# Altium project ESP_MusicToy.PrjPcb (part 1 of 2)
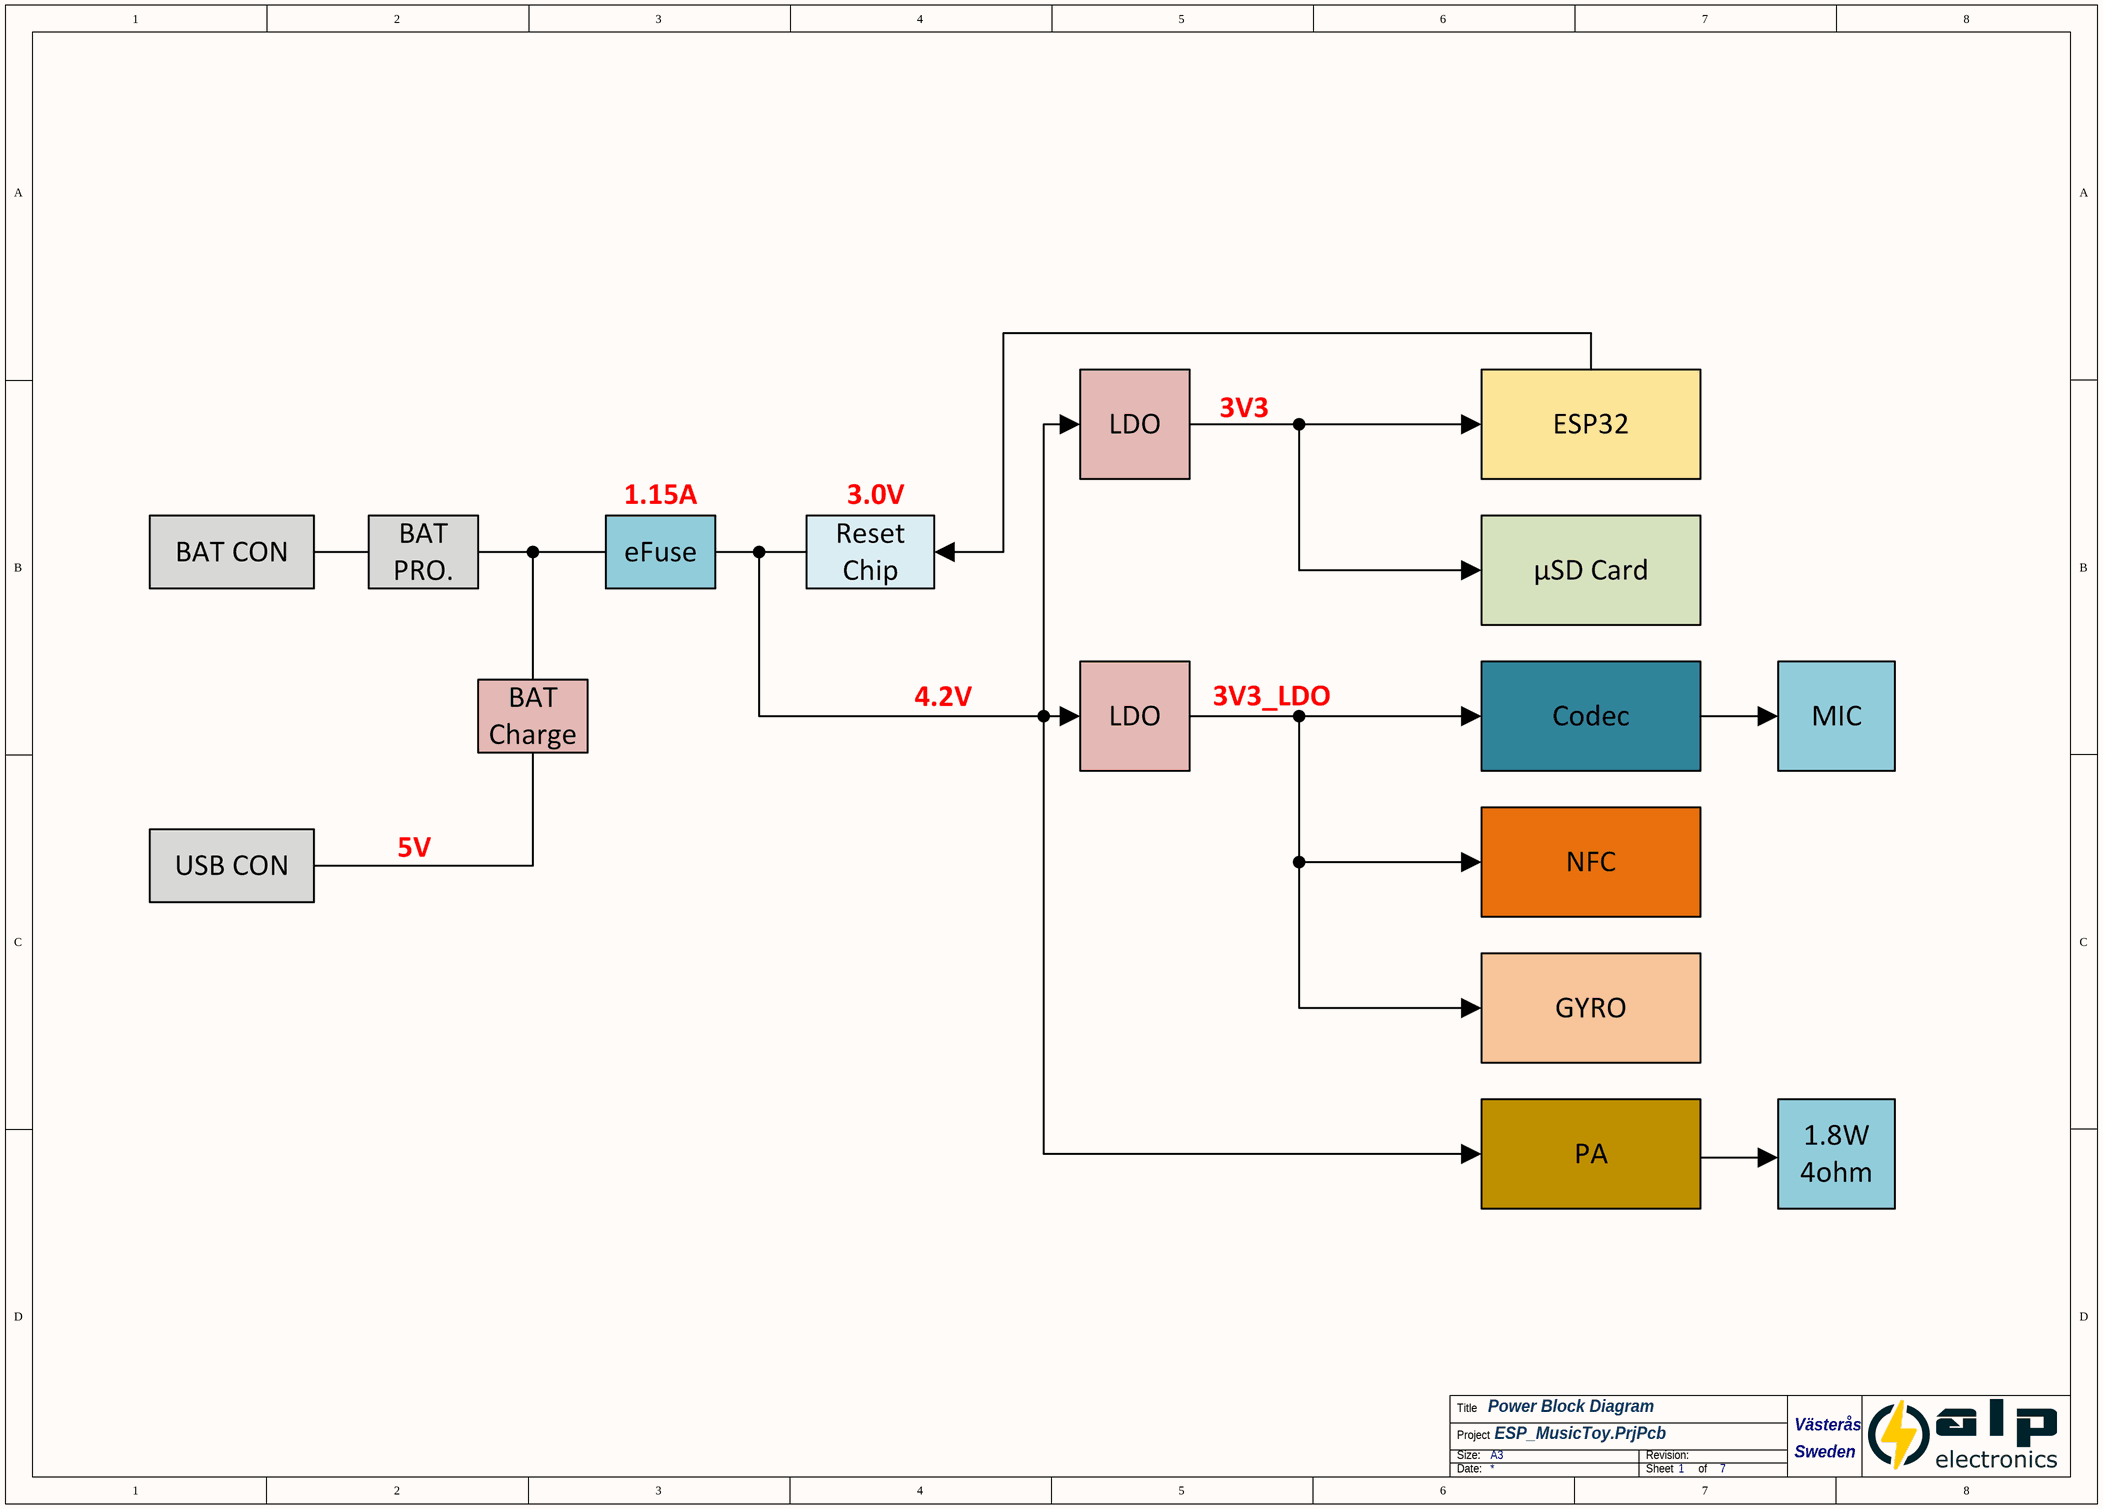
[diagram p0: [00] Power Block Diagram.SchDoc]
8 sheets, 197 parts. Net scope: flat (ports and power ports of the same name join across sheets).
Board file: ESP_MusicToy.PcbDoc
Sheets:
  [00] Power Block Diagram.SchDoc
  [01] System Block Diagram.SchDoc
  [02] ESP32-S2 Module.SchDoc
  [03] Codec.SchDoc
  [04] Power & Battery.SchDoc
  [05] NFC.SchDoc
  [06] Gyroscope.SchDoc
  [07] Information.SchDoc

## Sheet [00] Power Block Diagram.SchDoc: Power Block Diagram
size A3; Author: Caner ALP; Organization: ALP Electronics; Address1: Axel Oxenstiernas; Address2: Västerås; Address3: 72478; Address4: Sweden; DocumentNumber: 1; SheetNumber: 1; SheetTotal: 7

### Notes on the sheet
- Title
- Size:
- Project
- A3
- Revision:
- Date:
- Sheet
- of

## Sheet [01] System Block Diagram.SchDoc: System Block Diagram
size A3; Author: Caner ALP; Organization: ALP Electronics; Address1: Axel Oxenstiernas; Address2: Västerås; Address3: 72478; Address4: Sweden; DocumentNumber: 2; SheetNumber: 2; SheetTotal: 7

### Notes on the sheet
- Title
- Size:
- Project
- A3
- Revision:
- Date:
- Sheet
- of
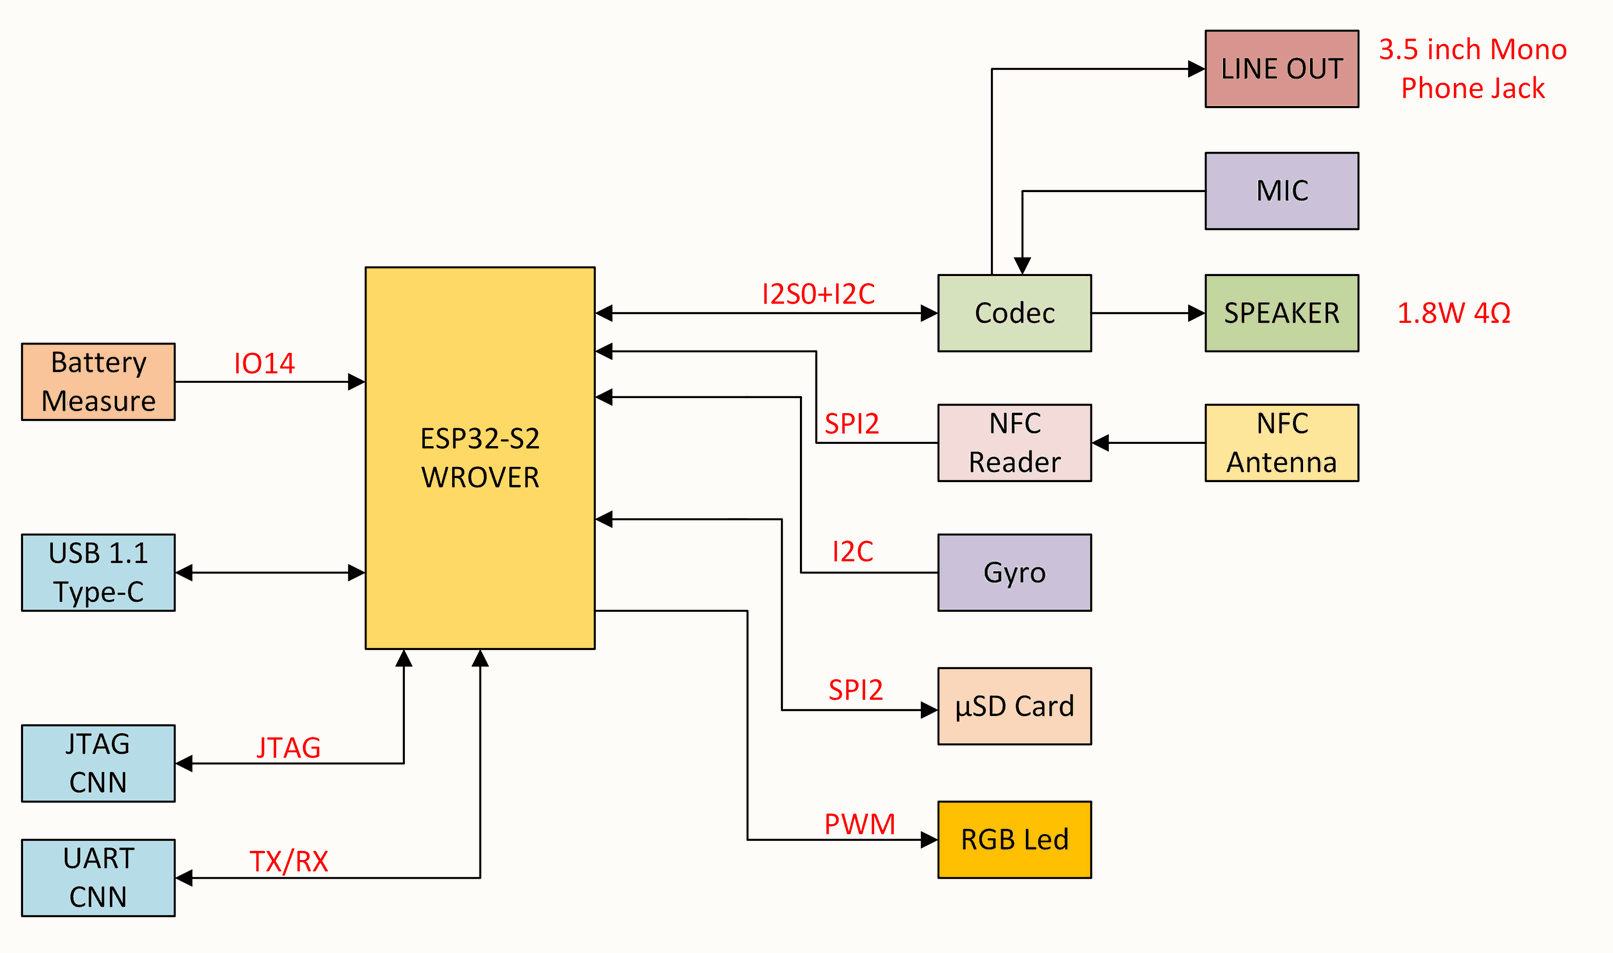
[diagram p1: [01] System Block Diagram.SchDoc]

## Sheet [02] ESP32-S2 Module.SchDoc: ESP32-S2 WROVER Module
size A3; Author: Caner ALP; Organization: ALP Electronics; Address1: Axel Oxenstiernas; Address2: Västerås; Address3: 72478; Address4: Sweden; DocumentNumber: 3; SheetNumber: 3; SheetTotal: 7
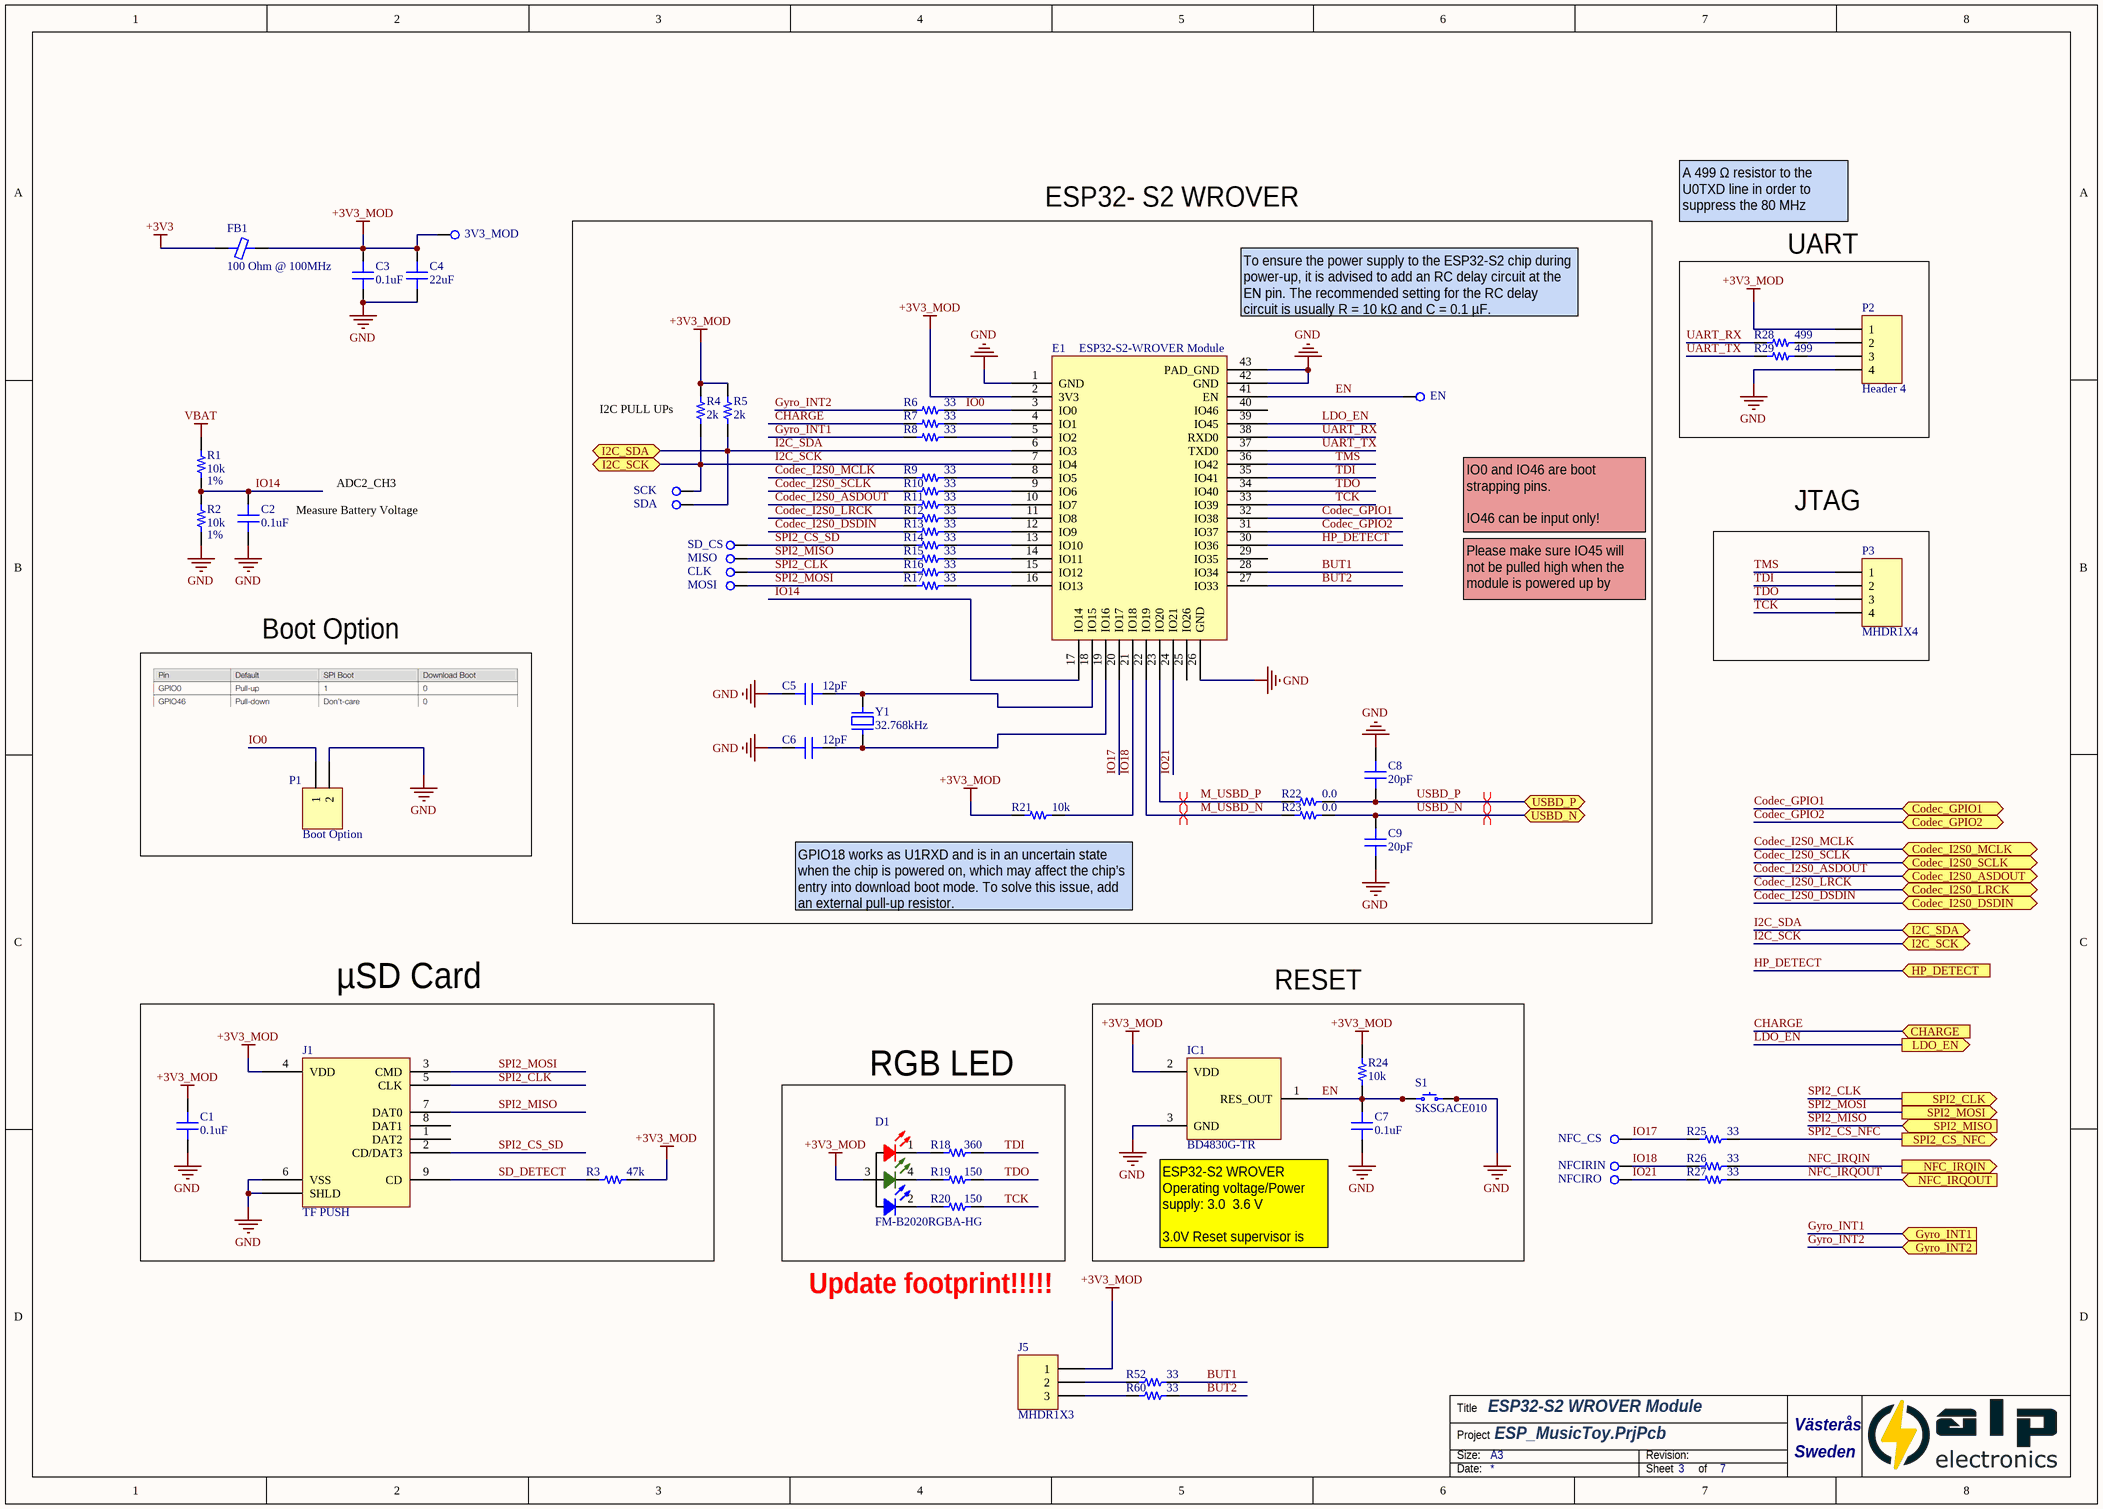
[diagram p2: [02] ESP32-S2 Module.SchDoc]

### Parts
3V3_MOD  RCT-0C  [TE TP 0805]  (value not drawn)
C1  0.1uF  [CAP 0402/1005]
C2  0.1uF  [CAP 0402/1005]
C3  0.1uF  [CAP 0402/1005]
C4  22uF  [CAP 0603/1608]
C5  12pF  [CAP 0402/1005]
C6  12pF  [CAP 0402/1005]
C7  0.1uF  [CAP 0402/1005]
C8  20pF  [CAP 0402/1005]
C9  20pF  [CAP 0402/1005]
CLK  RCT-0C  [0.5mm-TestPad]  (value not drawn)
D1  FM-B2020RGBA-HG  [FM-B2020RGBA-HG]
E1  ESP32-S2-WROVER Module  [ESP32-S2-WROVER]
EN  RCT-0C  [0.5mm-TestPad]  (value not drawn)
FB1  100 Ohm @ 100MHz  [FER 0805/2012]
IC1  BD4830G-TR  [TI SOT-23-5 DBV]
J1  TF PUSH  [TF-PUSH]
J5  MHDR1X3  [MHDR1X3]
MISO  RCT-0C  [0.5mm-TestPad]  (value not drawn)
MOSI  RCT-0C  [0.5mm-TestPad]  (value not drawn)
NFC_CS  RCT-0C  [0.5mm-TestPad]  (value not drawn)
NFCIRIN  RCT-0C  [0.5mm-TestPad]  (value not drawn)
NFCIRO  RCT-0C  [0.5mm-TestPad]  (value not drawn)
P1  Boot Option  [HDR1X2]
P2  Header 4  [HDR1X4]
P3  MHDR1X4  [MHDR1X4]
R1  10k  Tolerance: 1%  [RES 0402/1005]
R2  10k  Tolerance: 1%  [RES 0402/1005]
R3  47k  [RES 0402/1005]
R4  2k  [RES 0402/1005]
R5  2k  [RES 0402/1005]
R6  33  [RES 0402/1005]
R7  33  [RES 0402/1005]
R8  33  [RES 0402/1005]
R9  33  [RES 0402/1005]
R10  33  [RES 0402/1005]
R11  33  [RES 0402/1005]
R12  33  [RES 0402/1005]
R13  33  [RES 0402/1005]
R14  33  [RES 0402/1005]
R15  33  [RES 0402/1005]
R16  33  [RES 0402/1005]
R17  33  [RES 0402/1005]
R18  360  [RES 0402/1005]
R19  150  [RES 0402/1005]
R20  150  [RES 0402/1005]
R21  10k  [RES 0402/1005]
R22  0.0  [RES 0402/1005]
R23  0.0  [RES 0402/1005]
R24  10k  [RES 0402/1005]
R25  33  [RES 0402/1005]
R26  33  [RES 0402/1005]
R27  33  [RES 0402/1005]
R28  499  [RES 0402/1005]
R29  499  [RES 0402/1005]
R52  33  [RES 0402/1005]
R60  33  [RES 0402/1005]
S1  SKSGACE010  [SKSGACE010]
SCK  RCT-0C  [0.5mm-TestPad]  (value not drawn)
SD_CS  RCT-0C  [0.5mm-TestPad]  (value not drawn)
SDA  RCT-0C  [0.5mm-TestPad]  (value not drawn)
Y1  32.768kHz  [ABRACON ABS07]

### Blocks framed on the sheet
ESP32- S2 WROVER: C5 C6 C8 C9 CLK E1 EN MISO MOSI R4-R17 R21-R23 SCK SD_CS SDA Y1
UART: P2 R28 R29
JTAG: P3
Boot Option: P1
µSD Card: C1 J1 R3
RESET: C7 IC1 R24 S1
RGB LED: D1 R18-R20

### Ports
CHARGE (in), Codec_GPIO1 (bidir), Codec_GPIO2 (bidir), Codec_I2S0_ASDOUT (bidir), Codec_I2S0_DSDIN (bidir), Codec_I2S0_LRCK (bidir), Codec_I2S0_MCLK (bidir), Codec_I2S0_SCLK (bidir), Gyro_INT1 (in), Gyro_INT2 (in), HP_DETECT (in), I2C_SCK (bidir), I2C_SDA (bidir), LDO_EN (out), NFC_IRQIN (out), NFC_IRQOUT (in), SPI2_CLK (out), SPI2_CS_NFC (out), SPI2_MISO (in), SPI2_MOSI (out), USBD_N (bidir), USBD_P (bidir)

### Nets
+3V3: FB1.1
+3V3_MOD: 3V3_MOD.1(TP) C1.2 C3.2 C4.2 D1.3 E1.2(3V3) FB1.2 IC1.2(VDD) J1.4(VDD) J5.1 P2.1 R3.2 R4.2 R5.2 R21.1 R24.2
GND: C1.1 C2.1 C3.1 C4.1 C5.1 C6.1 C7.1 C8.2 C9.1 E1.1(GND) E1.26(GND) E1.42(GND) E1.43(PAD_GND) IC1.3(GND) J1.6(VSS) J1.G(SHLD) P1.2 P2.4 R2.1 S1.3 S1.4
VBAT: R1.2
BUT1: E1.28(IO34) R52.2
BUT2: E1.27(IO33) R60.2
CHARGE: R7.1 ; port CHARGE
Codec_GPIO1: E1.32(IO38) ; port Codec_GPIO1
Codec_GPIO2: E1.31(IO37) ; port Codec_GPIO2
Codec_I2S0_ASDOUT: R11.1 ; port Codec_I2S0_ASDOUT
Codec_I2S0_DSDIN: R13.1 ; port Codec_I2S0_DSDIN
Codec_I2S0_LRCK: R12.1 ; port Codec_I2S0_LRCK
Codec_I2S0_MCLK: R9.1 ; port Codec_I2S0_MCLK
Codec_I2S0_SCLK: R10.1 ; port Codec_I2S0_SCLK
EN: C7.2 E1.41(EN) EN.1(TP) IC1.1(RES_OUT) R24.1 S1.1 S1.2
Gyro_INT1: R8.1 ; port Gyro_INT1
Gyro_INT2: R6.1 ; port Gyro_INT2
HP_DETECT: E1.30(IO36) ; port HP_DETECT
I2C_SCK: E1.7(IO4) R4.1 SCK.1(TP) ; port I2C_SCK
I2C_SDA: E1.6(IO3) R5.1 SDA.1(TP) ; port I2C_SDA
IO0: E1.3(IO0) P1.1 R6.2
IO14: C2.2 E1.17(IO14) R1.1 R2.2
IO17: E1.20(IO17) NFC_CS.1(TP) R25.1
IO18: E1.21(IO18) NFCIRIN.1(TP) R21.2 R26.1
IO21: E1.24(IO21) NFCIRO.1(TP) R27.1
LDO_EN: E1.39(IO45) ; port LDO_EN
M_USBD_N: E1.22(IO19) R23.1
M_USBD_P: E1.23(IO20) R22.1
NFC_IRQIN: R26.2 ; port NFC_IRQIN
NFC_IRQOUT: R27.2 ; port NFC_IRQOUT
SD_DETECT: J1.9(CD) R3.1
SPI2_CLK: CLK.1(TP) J1.5(CLK) R16.1 ; port SPI2_CLK
SPI2_CS_NFC: R25.2 ; port SPI2_CS_NFC
SPI2_CS_SD: J1.2(CD/DAT3) R14.1 SD_CS.1(TP)
SPI2_MISO: J1.7(DAT0) MISO.1(TP) R15.1 ; port SPI2_MISO
SPI2_MOSI: J1.3(CMD) MOSI.1(TP) R17.1 ; port SPI2_MOSI
TCK: E1.33(IO39) P3.4 R20.2
TDI: E1.35(IO41) P3.2 R18.2
TDO: E1.34(IO40) P3.3 R19.2
TMS: E1.36(IO42) P3.1
UART_RX: E1.38(RXD0) R28.1
UART_TX: E1.37(TXD0) R29.1
USBD_N: C9.2 R23.2 ; port USBD_N
USBD_P: C8.1 R22.2 ; port USBD_P
NetC5_2: C5.2 E1.18(IO15) Y1.2
NetC6_2: C6.2 E1.19(IO16) Y1.1
NetD1_1: D1.1 R18.1
NetD1_2: D1.2 R20.1
NetD1_4: D1.4 R19.1
NetE1_4: E1.4(IO1) R7.2
NetE1_5: E1.5(IO2) R8.2
NetE1_8: E1.8(IO5) R9.2
NetE1_9: E1.9(IO6) R10.2
NetE1_10: E1.10(IO7) R11.2
NetE1_11: E1.11(IO8) R12.2
NetE1_12: E1.12(IO9) R13.2
NetE1_13: E1.13(IO10) R14.2
NetE1_14: E1.14(IO11) R15.2
NetE1_15: E1.15(IO12) R16.2
NetE1_16: E1.16(IO13) R17.2
NetJ5_2: J5.2 R52.1
NetJ5_3: J5.3 R60.1
NetP2_2: P2.2 R28.2
NetP2_3: P2.3 R29.2

Not connected (* = marked no-connect by the designer): E1 25(IO26) 29(IO35) 40(IO46); IC1 4(NC) 5(NC); J1 1(DAT2) 8(DAT1)

### Layout directives
differential pair; differential pair class DIFF_USB: M_USBD_N, M_USBD_P, USBD_N, USBD_P

### Notes on the sheet
- A 499 Ω resistor to the U0TXD line in order to suppress the 80 MHz harmonics.
- To ensure the power supply to the ESP32-S2 chip during power-up, it is advised to add an RC delay circuit at the EN pin. The recommended setting for the RC delay circuit is usually R = 10 kΩ and C = 0.1 µF.
- (near R4) I2C PULL UPs
- (near C2) Measure Battery Voltage
- ADC2_CH3
- IO0 and IO46 are boot strapping pins.
  IO46 can be input only!
- Please make sure IO45 will not be pulled high when the module is powered up by eternal circuit.
- (near R21) GPIO18 works as U1RXD and is in an uncertain state when the chip is powered on, which may affect the chip’s entry into download boot mode. To solve this issue, add an external pull-up resistor.
- ESP32-S2 WROVER Operating voltage/Power supply: 3.0  3.6 V
  3.0V Reset supervisor is used.
- Update footprint!!!!!
- Title
- Size:
- Project
- A3
- Revision:
- Date:
- Sheet
- of

### Library data of the parts
3V3_MOD CLK EN MISO MOSI NFC_CS NFCIRIN NFCIRO SCK SD_CS SDA = RCT-0C: 0805 PROBE PAD; Manufacturer: TE Connectivity AMP Connectors; Part Number: RCT-0C; PartId: 15704; Supplier 1: Digi-Key; Supplier Part Number 1: A106144CT-ND; ComponentLink1Description: Datasheet; ComponentLink1URL: http://www.te.com/commerce/DocumentDelivery/DDEController?Action=srchrtrv&DocNm=1773266&DocType=DS&DocLang=English; ComponentLink2Description: Digi-Key Listing; ComponentLink2URL: http://www.digikey.com/product-detail/en/te-connectivity-amp-connectors/RCT-0C/A106144CT-ND/3477801; Price: 0,14; Type: PC Test Point; Mounting Type: Surface Mount
C1-C3 C7 = C1005X7R1A104K050BB: CAP CER 0.1UF 10V X7R 0402; Manufacturer: TDK Corporation; TemperatureRange: -55C ~ 125C; Tolerance: 10%; Value: 0.1uF; Part Number: C1005X7R1A104K050BB; PartId: 3900; Supplier 1: Digi-Key; Supplier Part Number 1: 445-4958-2-ND; ComponentLink1Description: Datasheet; ComponentLink1URL: https://product.tdk.com/info/en/catalog/datasheets/mlcc_commercial_general_en.pdf; ComponentLink2Description: Digi-Key listing; ComponentLink2URL: http://digikey.com/product-detail/en/C1005X7R1A104K050BB/445-4958-2-ND/2093226; TemperatureCoefficient: X7R; Voltage: 10V; Price: 0,0066; Type: -; Device Package: 0402 (1005 Metric)
C4 = C1608X5R1A226M080AC: CAP CER 22UF 10V X5R 0603; Manufacturer: TDK Corporation; TemperatureRange: -55C ~ 85C; Tolerance: 20%; Value: 22uF; Part Number: C1608X5R1A226M080AC; PartId: 12987; Supplier 1: Digi-Key; Supplier Part Number 1: 445-9077-2-ND; ComponentLink1Description: Datasheet; ComponentLink1URL: https://product.tdk.com/info/en/catalog/datasheets/mlcc_commercial_general_en.pdf; ComponentLink2Description: Digi-Key Listing; ComponentLink2URL: https://www.digikey.com/product-detail/en/tdk-corporation/C1608X5R1A226M080AC/445-9077-2-ND/3661560; TemperatureCoefficient: X5R; Voltage: 10V; Price: 0,105; Device Package: 0603 (1608 Metric)
C5 C6 = GRM1555C1E120JA01D: CAP CER 12PF 25V NP0 0402; Manufacturer: Murata Electronics North America; TemperatureRange: -55C ~ 125C; TemperatureCoefficient: C0G, NP0; Tolerance: 5%; Value: 12pF; Part Number: GRM1555C1E120JA01D; PartId: 4929; Supplier 1: Digi-Key; Supplier Part Number 1: 490-8170-2-ND; ComponentLink1Description: Datasheet; ComponentLink1URL: http://www.murata.com/~/media/webrenewal/support/library/catalog/products/capacitor/mlcc/c02e.ashx; ComponentLink2Description: Digi-Key listing; ComponentLink2URL: http://digikey.com/product-detail/en/GRM1555C1E120JA01D/490-8170-2-ND/3693719; Voltage: 25V; Price: 0,0069; Type: -; Device Package: 0402 (1005 Metric)
C8 C9 = GRM1555C1E200JA01D: CAP CER 20PF 25V NP0 0402; Manufacturer: Murata Electronics North America; TemperatureRange: -55C ~ 125C; TemperatureCoefficient: C0G, NP0; Tolerance: 5%; Value: 20pF; Part Number: GRM1555C1E200JA01D; PartId: 5066; Supplier 1: Digi-Key; Supplier Part Number 1: 490-11364-2-ND; ComponentLink1Description: Datasheet; ComponentLink1URL: http://www.murata.com/~/media/webrenewal/support/library/catalog/products/capacitor/mlcc/c02e.ashx; ComponentLink2Description: Digi-Key listing; ComponentLink2URL: http://digikey.com/product-detail/en/GRM1555C1E200JA01D/490-11364-2-ND/3693725; Voltage: 25V; Price: 0,0118; Type: -; Device Package: 0402 (1005 Metric)
D1 = FM-B2020RGBA-HG: RGB 615~630nmRed,515~535nmGreen,465~480nmBlue 2020; Manufacturer: Foshan NationStar Optoelectronics; Value: Green; Type: Surface Mount; Part Number: FM-B2020RGBA-HG; PartId: 10872; Supplier 1: LCSC; Supplier Part Number 1: C108793; ComponentLink1Description: Datasheet; ComponentLink1URL: https://datasheet.lcsc.com/szlcsc/1810231210_Foshan-NationStar-Optoelectronics-FM-B2020RGBA-HG_C108793.pdf; ComponentLink2Description: LCSC Listing; ComponentLink2URL: https://lcsc.com/product-detail/Light-Emitting-Diodes-LED_FM-B2020RGBA-HG_C108793.html; Device Package: 2020; Colour: RGB
FB1 = CIC21P101NE: FERRITE CHIP 100 OHM 2000MA 0805; Manufacturer: Samsung Electro-Mechanics America, Inc.; Type: Differential Mode - Single; DC Resistance: 20 mOhm Max; Current Rating: 2A; Part Number: CIC21P101NE; PartId: 6759; Value: 100 Ohm @ 100MHz; Supplier 1: Digi-Key; Supplier Part Number 1: 1276-6374-2-ND; ComponentLink1Description: Datasheet; ComponentLink1URL: http://www.samsungsem.com/kr/front/downloadcms.do?path=/kr/support/product-search/bead/__icsFiles/afieldfile/2014/11/13&fileName=S_CIC21J121NE.pdf; ComponentLink2Description: Digi-Key listing; ComponentLink2URL: http://digikey.com/product-detail/en/CIC21P101NE/1276-6374-2-ND/3973735; Price: 0,0163; Device Package: 0805 (2012 Metric)
IC1 = BD4830G-TR: IC MPU RESET CIRC 3V SOT23-5; Manufacturer: ROHM Semiconductor; Voltages Monitored: 1; Output: Open Drain or Open Collector; Reset: Active High; Voltage - Threshold: 3.0V; Part Number: BD4830G-TR; PartId: 16401; Supplier 1: LCSC; Supplier Part Number 1: C507475; ComponentLink1Description: Datasheet; ComponentLink1URL: https://datasheet.lcsc.com/szlcsc/2005211231_ROHM-Semicon-BD4830G-TR_C507475.pdf; ComponentLink2Description: LCSC Listing; ComponentLink2URL: https://lcsc.com/product-detail/PMIC-Supervisors_ROHM-Semicon-BD4830G-TR_C507475.html; Type: Simple Reset/Power-On Reset; Device Package: SOT23-5
J1 = TF PUSH: MICRO SD PUSH/PUSH SMALL 8C; Manufacturer: SHOU HAN; Number of Positions: 9(8 + 1); Connector Type: Connector and Ejector; Part Number: TF PUSH; PartId: 9290; Supplier 1: LCSC; Supplier Part Number 1: C393941; ComponentLink1Description: Datasheet; ComponentLink1URL: https://datasheet.lcsc.com/szlcsc/1912111437_SHOU-HAN-TF-PUSH_C393941.pdf; ComponentLink2Description: LCSC Listing; ComponentLink2URL: https://lcsc.com/product-detail/Card-Sockets-Connectors_SHOU-HAN-TF-PUSH_C393941.html; Type: Connector and Ejector; Mounting Type: Surface Mount, Right Angle; Features: Switch; Contact Finish: Nickel
J5 = MHDR1X3: Header, 3-Pin; LatestRevisionDate: 17-Jul-2002; LatestRevisionNote: Re-released for DXP Platform.; Publisher: Altium Limited
P1 = Header 2: Header, 2-Pin; LatestRevisionDate: 17-Jul-2002; LatestRevisionNote: Re-released for DXP Platform.; Publisher: Altium Limited
P2 = Header 4: Header, 4-Pin; LatestRevisionDate: 17-Jul-2002; LatestRevisionNote: Re-released for DXP Platform.; Publisher: Altium Limited
P3 = MHDR1X4: Header, 4-Pin; LatestRevisionDate: 17-Jul-2002; LatestRevisionNote: Re-released for DXP Platform.; Publisher: Altium Limited
R1 R2 = ERJ-2RKF1002X: RES SMD 10K OHM 1% 1/10W 0402; Manufacturer: Panasonic Electronic Components; TemperatureRange: -55C ~ 155C; TemperatureCoefficient: 100ppm/C; PowerRating: 0.1W, 1/10W; Value: 10k; Part Number: ERJ-2RKF1002X; PartId: 1; Supplier 1: Digi-Key; Supplier Part Number 1: P10.0KLTR-ND; ComponentLink1Description: Datasheet; ComponentLink1URL: http://industrial.panasonic.com/www-cgi/jvcr13pz.cgi?E+PZ+3+AOA0002+ERJ2RKF1002X+7+WW; ComponentLink2Description: Digikey listing; ComponentLink2URL: http://digikey.com/product-detail/en/ERJ-2RKF1002X/P10.0KLTR-ND/192073; Price: 0,0043; Type: Thick Film; Device Package: 0402 (1005 Metric)
R3 = RC0402JR-0747KL: RES SMD 47K OHM 5% 1/16W 0402; Manufacturer: Yageo; TemperatureRange: -55C ~ 155C; TemperatureCoefficient: 100ppm/C; PowerRating: 0.063W, 1/16W; Value: 47k; Part Number: RC0402JR-0747KL; PartId: 14467; Supplier 1: Digi-Key; Supplier Part Number 1: 311-47KJRTR-ND; ComponentLink1Description: Datasheet; ComponentLink1URL: http://www.yageo.com/documents/recent/PYu-RC_Group_51_RoHS_L_04.pdf; ComponentLink2Description: Digi-Key Listing; ComponentLink2URL: https://www.digikey.com/product-detail/en/yageo/RC0402JR-0747KL/311-47KJRTR-ND/726485; Tolerance: 5%; Price: 0,0017; Device Package: 0402 (1005 Metric)
R4 R5 = ERJ-2GEJ202X: RES SMD 2K OHM 5% 1/10W 0402; Manufacturer: Panasonic Electronic Components; TemperatureRange: -55C ~ 155C; TemperatureCoefficient: 200ppm/C; PowerRating: 0.1W, 1/10W; Value: 2k; Part Number: ERJ-2GEJ202X; PartId: 11049; Supplier 1: Digi-Key; Supplier Part Number 1: P2.0KJTR-ND; ComponentLink1Description: Datasheet; ComponentLink1URL: http://industrial.panasonic.com/www-cgi/jvcr13pz.cgi?E+PZ+3+AOA0001+ERJ2GEJ202X+7+WW; ComponentLink2Description: Digi-Key Listing; ComponentLink2URL: https://www.digikey.com/product-detail/en/panasonic-electronic-components/ERJ-2GEJ202X/P2.0KJTR-ND/146958; Tolerance: 5%; Price: 0,0019; Device Package: 0402 (1005 Metric)
R6-R17 R25-R27 R52 R60 = ERJ-2GEJ330X: RES SMD 33 OHM 5% 1/10W 0402; Manufacturer: Panasonic Electronic Components; TemperatureRange: -55C ~ 155C; TemperatureCoefficient: 200ppm/C; PowerRating: 0.1W, 1/10W; Value: 33; Part Number: ERJ-2GEJ330X; PartId: 10984; Supplier 1: Digi-Key; Supplier Part Number 1: P33JTR-ND; ComponentLink1Description: Datasheet; ComponentLink1URL: http://industrial.panasonic.com/www-cgi/jvcr13pz.cgi?E+PZ+3+AOA0001+ERJ2GEJ330X+7+WW; ComponentLink2Description: Digi-Key Listing; ComponentLink2URL: https://www.digikey.com/product-detail/en/panasonic-electronic-components/ERJ-2GEJ330X/P33JTR-ND/146980; Tolerance: 5%; Price: 0,0019; Device Package: 0402 (1005 Metric)
R18 = RC0402JR-07360RL: RES SMD 360 OHM 5% 1/16W 0402; Manufacturer: Yageo; TemperatureRange: -55C ~ 155C; TemperatureCoefficient: 100ppm/C; PowerRating: 0.063W, 1/16W; Value: 360; Part Number: RC0402JR-07360RL; PartId: 14562; Supplier 1: Digi-Key; Supplier Part Number 1: 311-360JRTR-ND; ComponentLink1Description: Datasheet; ComponentLink1URL: http://www.yageo.com/documents/recent/PYu-RC_Group_51_RoHS_L_04.pdf; ComponentLink2Description: Digi-Key Listing; ComponentLink2URL: https://www.digikey.com/product-detail/en/yageo/RC0402JR-07360RL/311-360JRTR-ND/726469; Tolerance: 5%; Price: 0,0017; Device Package: 0402 (1005 Metric)
R19 R20 = RC0402JR-07150RL: RES SMD 150 OHM 5% 1/16W 0402; Manufacturer: Yageo; TemperatureRange: -55C ~ 155C; TemperatureCoefficient: 100ppm/C; PowerRating: 0.063W, 1/16W; Value: 150; Part Number: RC0402JR-07150RL; PartId: 14495; Supplier 1: Digi-Key; Supplier Part Number 1: 311-150JRTR-ND; ComponentLink1Description: Datasheet; ComponentLink1URL: http://www.yageo.com/documents/recent/PYu-RC_Group_51_RoHS_L_04.pdf; ComponentLink2Description: Digi-Key Listing; ComponentLink2URL: https://www.digikey.com/product-detail/en/yageo/RC0402JR-07150RL/311-150JRTR-ND/726424; Tolerance: 5%; Price: 0,0017; Device Package: 0402 (1005 Metric)
R21 R24 = RC0402JR-0710KL: RES SMD 10K OHM 5% 1/16W 0402; Manufacturer: Yageo; TemperatureRange: -55C ~ 155C; TemperatureCoefficient: 100ppm/C; PowerRating: 0.063W, 1/16W; Value: 10k; Part Number: RC0402JR-0710KL; PartId: 14464; Supplier 1: Digi-Key; Supplier Part Number 1: 311-10KJRTR-ND; ComponentLink1Description: Datasheet; ComponentLink1URL: http://www.yageo.com/documents/recent/PYu-RC_Group_51_RoHS_L_04.pdf; ComponentLink2Description: Digi-Key Listing; ComponentLink2URL: https://www.digikey.com/product-detail/en/yageo/RC0402JR-0710KL/311-10KJRTR-ND/726418; Tolerance: 5%; Price: 0,0017; Device Package: 0402 (1005 Metric)
R22 R23 = AC0402JR-070RL: RES SMD 0.0OHM JUMPER 1/16W 0402; Manufacturer: Yageo; TemperatureRange: -55C ~ 155C; PowerRating: 0.063W, 1/16W; Value: 0.0; Part Number: AC0402JR-070RL; PartId: 16139; Supplier 1: Digi-Key; Supplier Part Number 1: 311-0.0LBTR-ND; ComponentLink1Description: Datasheet; ComponentLink1URL: http://www.yageo.com/NewPortal/yageodocoutput?fileName=/pdf/R-Chip/PYu-AC_51_RoHS_L_5.pdf; ComponentLink2Description: Digi-Key Listing; ComponentLink2URL: https://www.digikey.com/product-detail/en/yageo/AC0402JR-070RL/311-0.0LBTR-ND/2827807; Tolerance: Jumper; Price: 0,0027; Device Package: 0402 (1005 Metric)
R28 R29 = ERJ-2RKF4990X: RES SMD 499 OHM 1% 1/10W 0402; Manufacturer: Panasonic Electronic Components; TemperatureRange: -55C ~ 155C; TemperatureCoefficient: 100ppm/C; PowerRating: 0.1W, 1/10W; Value: 499; Part Number: ERJ-2RKF4990X; PartId: 24; Supplier 1: Digi-Key; Supplier Part Number 1: P499LTR-ND; ComponentLink1Description: Datasheet; ComponentLink1URL: http://industrial.panasonic.com/www-cgi/jvcr13pz.cgi?E+PZ+3+AOA0002+ERJ2RKF4990X+7+WW; ComponentLink2Description: Digikey listing; ComponentLink2URL: http://digikey.com/product-detail/en/ERJ-2RKF4990X/P499LTR-ND/192384; Tolerance: 1%; Price: 0,0043; Type: Thick Film; Device Package: 0402 (1005 Metric)
S1 = SKSGACE010: SWITCH TACTILE SPST-NO 0.05A 16V; Manufacturer: ALPS; Part Number: SKSGACE010; PartId: 16471; Supplier 1: Mouser; Supplier Part Number 1: 688-SKSGACE010; ComponentLink1Description: Datasheet; ComponentLink1URL: https://www.mouser.se/datasheet/2/15/SKSG-1370727.pdf; ComponentLink2Description: Mouser Listing; ComponentLink2URL: https://www.mouser.se/ProductDetail/ALPS/SKSGACE010?qs=Ptl%2FSkKmb3BEFq%252BG855%2Fog==
Y1 = ABS07-32.768KHZ-T: CRYSTAL 32.7680KHZ 12.5PF SMD; Manufacturer: Abracon LLC; Frequency Tolerance: 20ppm; ESR: 70 kOhm; Operating Mode: Fundamental; Part Number: ABS07-32.768KHZ-T; PartId: 8487; Supplier 1: Digi-Key; Supplier Part Number 1: 535-9542-2-ND; ComponentLink1Description: Datasheet; ComponentLink1URL: http://www.abracon.com/Resonators/ABS07.pdf; ComponentLink2Description: Digi-Key Listing; ComponentLink2URL: http://www.digikey.com/product-detail/en/ABS07-32.768KHZ-T/535-9542-2-ND/1236858; Price: 0,3; Type: kHz Crystal (Tuning Fork); Device Package: 2-SMD; Frequency: 32.768kHz; Frequency Stability: -; Load Capacitance: 12.5pF

## Sheet [03] Codec.SchDoc: Codec
size A3; Author: Caner ALP; Organization: ALP Electronics; Address1: Axel Oxenstiernas; Address2: Västerås; Address3: 72478; Address4: Sweden; DocumentNumber: 4; SheetNumber: 4; SheetTotal: 7
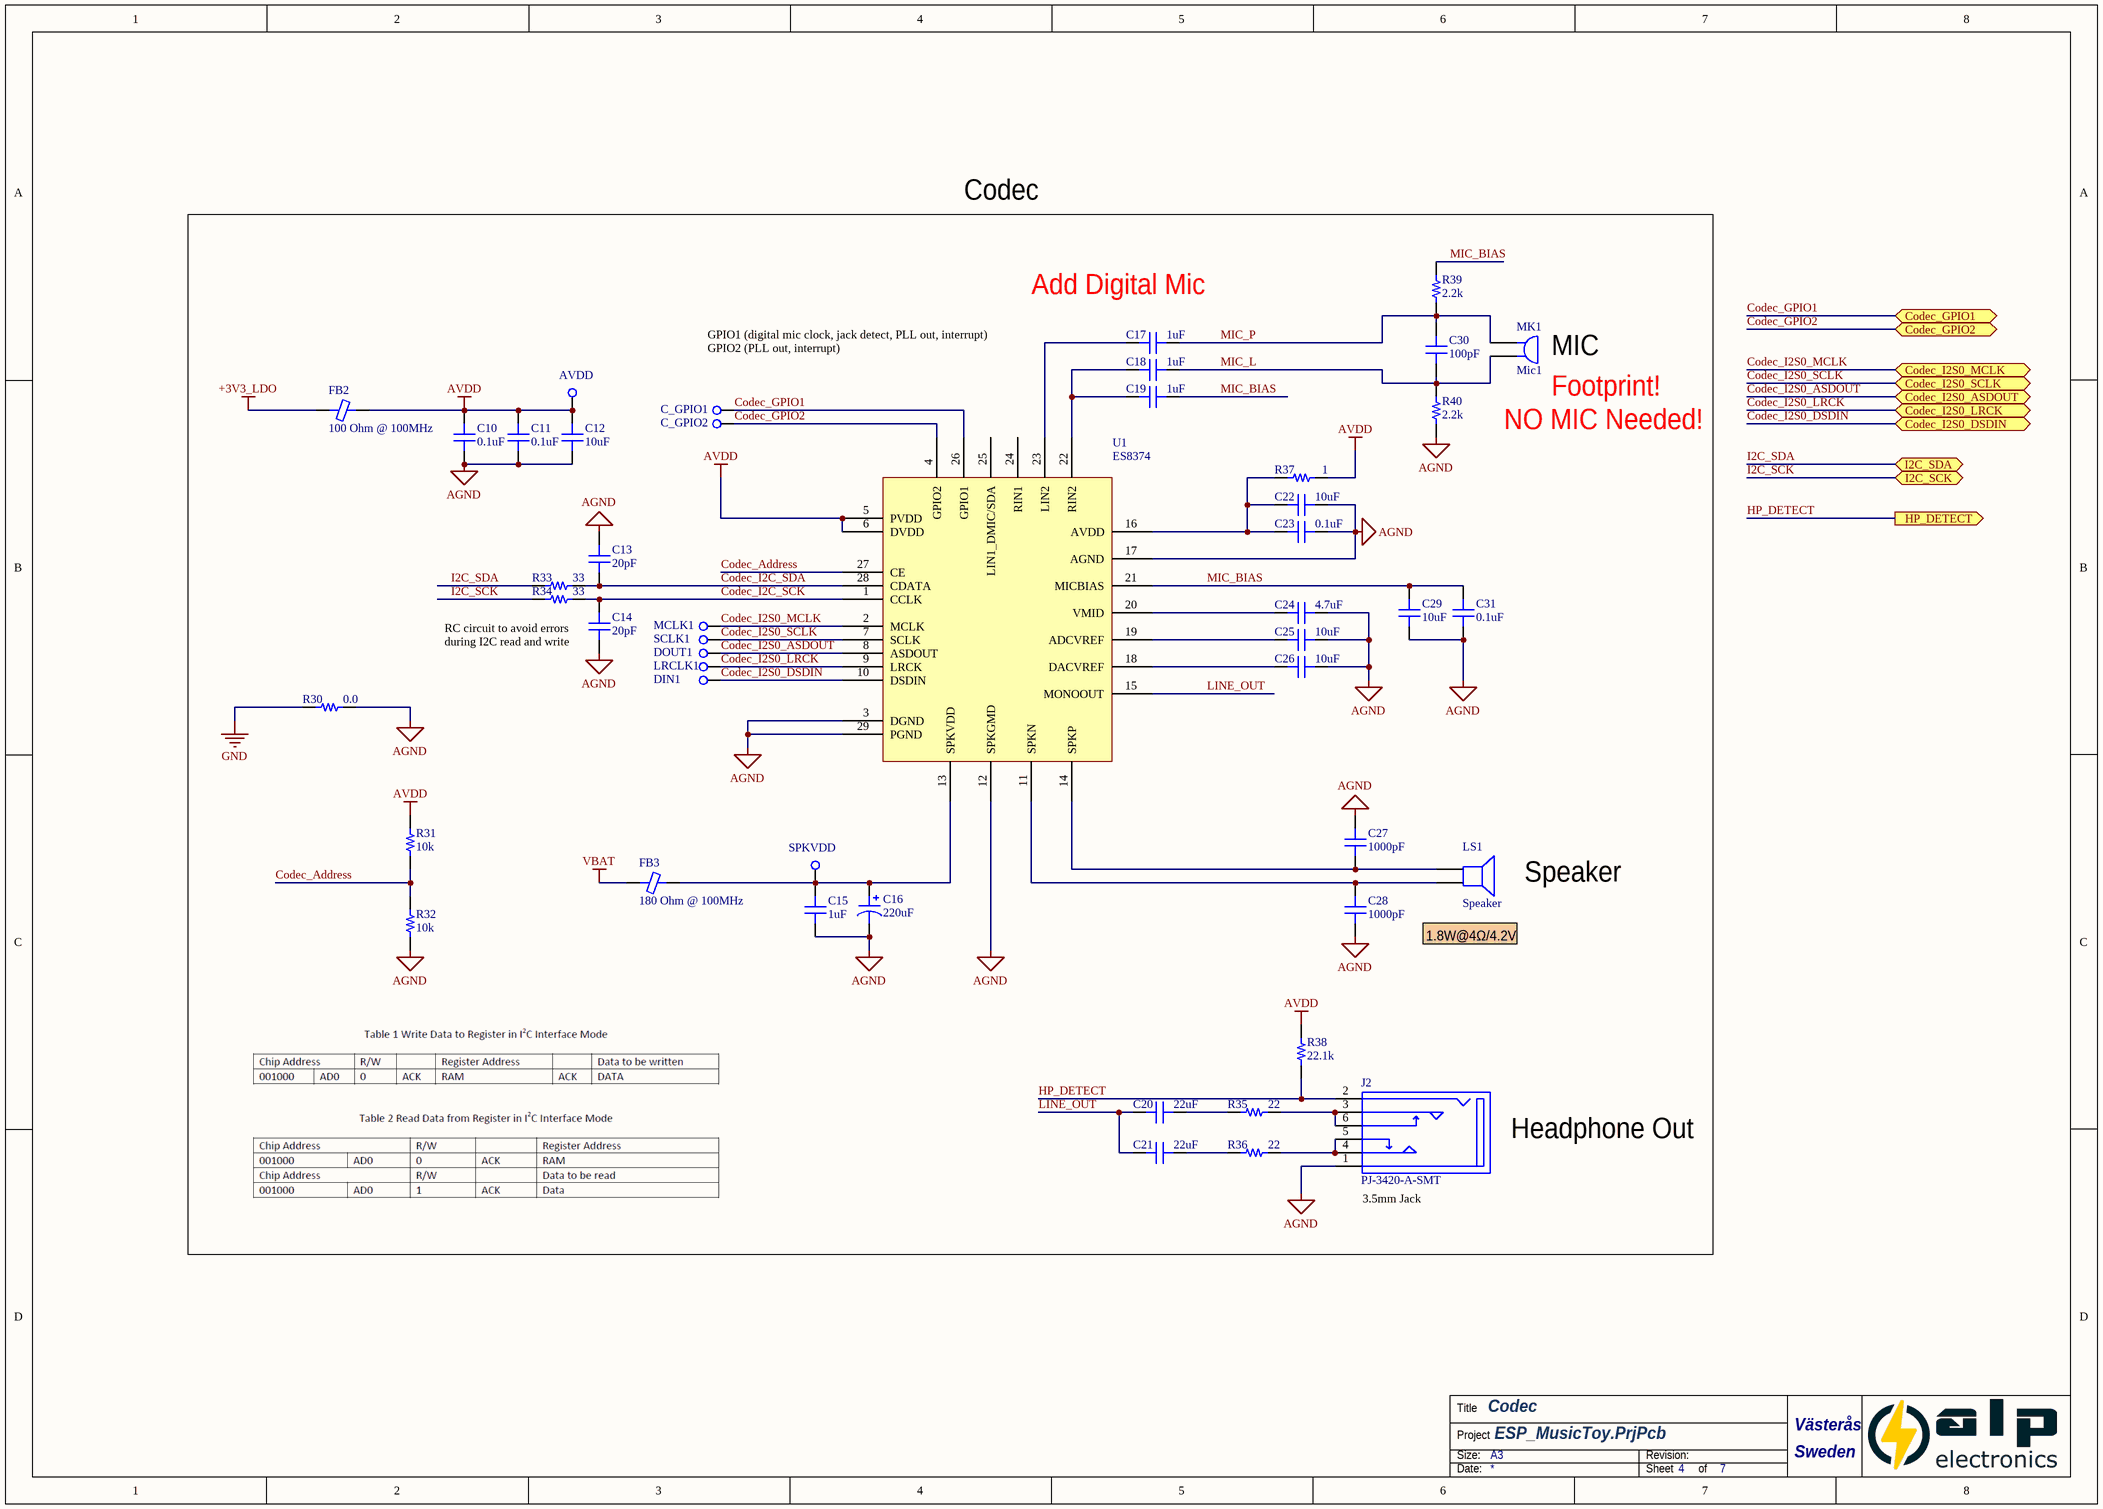
[diagram p3: [03] Codec.SchDoc]

### Parts
AVDD  RCT-0C  [0.5mm-TestPad]  (value not drawn)
C10  0.1uF  [CAP 0603/1608]
C11  0.1uF  [CAP 0603/1608]
C12  10uF  [CAP 0603/1608]
C13  20pF  [CAP 0402/1005]
C14  20pF  [CAP 0402/1005]
C15  1uF  [CAP 0603/1608]
C16  220uF  [CAP ALUM 6.6MM]
C17  1uF  [CAP 0603/1608]
C18  1uF  [CAP 0603/1608]
C19  1uF  [CAP 0603/1608]
C20  22uF  [CAP 0603/1608]
C21  22uF  [CAP 0603/1608]
C22  10uF  [CAP 0603/1608]
C23  0.1uF  [CAP 0603/1608]
C24  4.7uF  [CAP 0603/1608]
C25  10uF  [CAP 0603/1608]
C26  10uF  [CAP 0603/1608]
C27  1000pF  [CAP 0603/1608]
C28  1000pF  [CAP 0603/1608]
C29  10uF  [CAP 0603/1608]
C30  100pF  [CAP 0402/1005]
C31  0.1uF  [CAP 0603/1608]
C_GPIO1  RCT-0C  [0.5mm-TestPad]  (value not drawn)
C_GPIO2  RCT-0C  [0.5mm-TestPad]  (value not drawn)
DIN1  RCT-0C  [0.5mm-TestPad]  (value not drawn)
DOUT1  RCT-0C  [0.5mm-TestPad]  (value not drawn)
FB2  100 Ohm @ 100MHz  [FER 0805/2012]
FB3  180 Ohm @ 100MHz  [FER 0805/2012]
J2  PJ-3420-A-SMT  [PJ-3420-A-SMT]
LRCLK1  RCT-0C  [0.5mm-TestPad]  (value not drawn)
LS1  Speaker  [JST XH B2B-XH-A]
MCLK1  RCT-0C  [0.5mm-TestPad]  (value not drawn)
MK1  Mic1  [HDR1X2]
R30  0.0  [RES 0805/2012]
R31  10k  [RES 0402/1005]
R32  10k  [RES 0402/1005]
R33  33  [RES 0402/1005]
R34  33  [RES 0402/1005]
R35  22  [RES 0603/1608]
R36  22  [RES 0603/1608]
R37  1  [RES 0603/1608]
R38  22.1k  [RES 0402/1005]
R39  2.2k  [RES 0402/1005]
R40  2.2k  [RES 0402/1005]
SCLK1  RCT-0C  [0.5mm-TestPad]  (value not drawn)
SPKVDD  RCT-0C  [0.5mm-TestPad]  (value not drawn)
U1  ES8374  [QFN28 4x4mm 0.4mm Pitch]

### Ports
Codec_GPIO1 (bidir), Codec_GPIO2 (bidir), Codec_I2S0_ASDOUT (bidir), Codec_I2S0_DSDIN (bidir), Codec_I2S0_LRCK (bidir), Codec_I2S0_MCLK (bidir), Codec_I2S0_SCLK (bidir), HP_DETECT (out), I2C_SCK (bidir), I2C_SDA (bidir)

### Nets
+3V3_LDO: FB2.1
AGND: C10.1 C11.1 C12.1 C13.2 C14.1 C15.2 C16.2 C22.2 C23.1 C24.2 C25.2 C26.2 C27.2 C28.1 C29.1 C31.1 J2.1 R30.2 R32.1 R40.1 U1.3(DGND) U1.12(SPKGMD) U1.17(AGND) U1.29(PGND)
AVDD: AVDD.1(TP) C10.2 C11.2 C12.2 FB2.2 R31.2 R37.1 R38.2 U1.5(PVDD) U1.6(DVDD)
GND: R30.1
VBAT: FB3.1
Codec_Address: R31.1 R32.2 U1.27(CE)
Codec_GPIO1: C_GPIO1.1(TP) U1.26(GPIO1) ; port Codec_GPIO1
Codec_GPIO2: C_GPIO2.1(TP) U1.4(GPIO2) ; port Codec_GPIO2
Codec_I2C_SCK: C14.2 R34.2 U1.1(CCLK)
Codec_I2C_SDA: C13.1 R33.2 U1.28(CDATA)
Codec_I2S0_ASDOUT: DOUT1.1(TP) U1.8(ASDOUT) ; port Codec_I2S0_ASDOUT
Codec_I2S0_DSDIN: DIN1.1(TP) U1.10(DSDIN) ; port Codec_I2S0_DSDIN
Codec_I2S0_LRCK: LRCLK1.1(TP) U1.9(LRCK) ; port Codec_I2S0_LRCK
Codec_I2S0_MCLK: MCLK1.1(TP) U1.2(MCLK) ; port Codec_I2S0_MCLK
Codec_I2S0_SCLK: SCLK1.1(TP) U1.7(SCLK) ; port Codec_I2S0_SCLK
HP_DETECT: J2.2 R38.1 ; port HP_DETECT
I2C_SCK: R34.1 ; port I2C_SCK
I2C_SDA: R33.1 ; port I2C_SDA
LINE_OUT: C20.1 C21.1 U1.15(MONOOUT)
MIC_BIAS: C19.1 C29.2 C31.2 R39.2 U1.21(MICBIAS)
MIC_L: C18.1 C30.1 MK1.2 R40.2
MIC_P: C17.1 C30.2 MK1.1 R39.1
NetC15_1: C15.1 C16.1 FB3.2 SPKVDD.1(TP) U1.13(SPKVDD)
NetC17_2: C17.2 U1.23(LIN2)
NetC18_2: C18.2 C19.2 U1.22(RIN2)
NetC20_2: C20.2 R35.1
NetC21_2: C21.2 R36.1
NetC22_1: C22.1 C23.2 R37.2 U1.16(AVDD)
NetC24_1: C24.1 U1.20(VMID)
NetC25_1: C25.1 U1.19(ADCVREF)
NetC26_1: C26.1 U1.18(DACVREF)
NetC27_1: C27.1 LS1.1 U1.14(SPKP)
NetC28_2: C28.2 LS1.2 U1.11(SPKN)
NetJ2_3: J2.3 J2.6 R35.2
NetJ2_4: J2.4 J2.5 R36.2

Not connected (* = marked no-connect by the designer): U1 24(RIN1) 25(LIN1_DMIC/SDA)

### Notes on the sheet
- Codec
- (near C17) Add Digital Mic
- GPIO1 (digital mic clock, jack detect, PLL out, interrupt)
- GPIO2 (PLL out, interrupt)
- (near MK1) MIC
- NO MIC Needed!
- (near MK1) Footprint!
- RC circuit to avoid errors
  during I2C read and write
- Speaker
- (near LS1) 1.8W@4Ω/4.2V
- Headphone Out
- (near J2) 3.5mm Jack
- Title
- Size:
- Project
- A3
- Revision:
- Date:
- Sheet
- of

### Library data of the parts
AVDD C_GPIO1 C_GPIO2 DIN1 DOUT1 LRCLK1 MCLK1 SCLK1 SPKVDD = RCT-0C: as 3V3_MOD on sheet [02] ESP32-S2 Module; Part Number: RCT-0C; PartId: 15704; Supplier 1: Digi-Key; Supplier Part Number 1: A106144CT-ND; ComponentLink1Description: Datasheet; ComponentLink1URL: http://www.te.com/commerce/DocumentDelivery/DDEController?Action=srchrtrv&DocNm=1773266&DocType=DS&DocLang=English; ComponentLink2Description: Digi-Key Listing; ComponentLink2URL: http://www.digikey.com/product-detail/en/te-connectivity-amp-connectors/RCT-0C/A106144CT-ND/3477801; Price: 0,14; Type: PC Test Point; Mounting Type: Surface Mount
C10 C11 C23 C31 = CC0603KPX7R7BB104: CAP CER 0.1UF 16V X7R 0603; Manufacturer: Yageo; TemperatureRange: -55C ~ 125C; Tolerance: 10%; Value: 0.1uF; Part Number: CC0603KPX7R7BB104; PartId: 5262; Supplier 1: Digi-Key; Supplier Part Number 1: 311-1335-2-ND; ComponentLink1Description: Datasheet; ComponentLink1URL: http://www.yageo.com/documents/recent/UPY-GPHC_X7R_6.3V-to-50V-v12.pdf; ComponentLink2Description: Digi-Key listing; ComponentLink2URL: http://digikey.com/product-detail/en/CC0603KPX7R7BB104/311-1335-2-ND/2103073; TemperatureCoefficient: X7R; Voltage: 16V; Price: 0,0043; Type: -; Device Package: 0603 (1608 Metric)
C12 C22 C25 C26 C29 = C1608X5R1A106M080AC: CAP CER 10UF 10V X5R 0603; Manufacturer: TDK Corporation; TemperatureRange: -55C ~ 85C; Tolerance: 20%; Value: 10uF; Part Number: C1608X5R1A106M080AC; PartId: 13099; Supplier 1: Digi-Key; Supplier Part Number 1: 445-6853-2-ND; ComponentLink1Description: Datasheet; ComponentLink1URL: https://product.tdk.com/info/en/catalog/datasheets/mlcc_commercial_general_en.pdf; ComponentLink2Description: Digi-Key Listing; ComponentLink2URL: https://www.digikey.com/product-detail/en/tdk-corporation/C1608X5R1A106M080AC/445-6853-2-ND/2619194; TemperatureCoefficient: X5R; Voltage: 10V; Price: 0,0935; Device Package: 0603 (1608 Metric)
C13 C14 = GRM1555C1E200JA01D: as C8 on sheet [02] ESP32-S2 Module; Value: 20pF; Part Number: GRM1555C1E200JA01D; PartId: 5066; Supplier 1: Digi-Key; Supplier Part Number 1: 490-11364-2-ND; ComponentLink1Description: Datasheet; ComponentLink1URL: http://www.murata.com/~/media/webrenewal/support/library/catalog/products/capacitor/mlcc/c02e.ashx; ComponentLink2Description: Digi-Key listing; ComponentLink2URL: http://digikey.com/product-detail/en/GRM1555C1E200JA01D/490-11364-2-ND/3693725; Voltage: 25V; Price: 0,0118; Type: -; Device Package: 0402 (1005 Metric)
C15 C17-C19 = CGB3B1X7R1A105K055AC: CAP CER 1UF 10V X7R 0603; Manufacturer: TDK Corporation; TemperatureRange: -55C ~ 125C; Tolerance: 10%; Type: Low Profile; Value: 1uF; Part Number: CGB3B1X7R1A105K055AC; PartId: 4131; Supplier 1: Digi-Key; Supplier Part Number 1: 445-13228-1-ND; ComponentLink1Description: Datasheet; ComponentLink1URL: https://product.tdk.com/info/en/catalog/datasheets/mlcc_commercial_lowprofile_en.pdf; ComponentLink2Description: Digi-Key listing; ComponentLink2URL: http://digikey.com/product-detail/en/CGB3B1X7R1A105K055AC/445-13228-1-ND/3954894; TemperatureCoefficient: X7R; Voltage: 10V; Price: 0,27; Device Package: 0603 (1608 Metric)
C16 = EEE-1CA221XP: CAP ALUM 220UF 20% 16V SMD; Manufacturer: Panasonic Electronic Components; TemperatureRange: -40C ~ 85C; Type: Automotive; Ripple Current: 162mA; Lifetime @ Temp: 2000 Hrs @ 85C; Value: 220uF; Part Number: EEE-1CA221XP; PartId: 7248; Supplier 1: Digi-Key; Supplier Part Number 1: PCE3885TR-ND; ComponentLink1Description: Datasheet; ComponentLink1URL: http://media.digikey.com/pdf/Data%20Sheets/Panasonic%20Electronic%20Components/S_Series_Type_V.pdf; ComponentLink2Description: Digi-Key listing; ComponentLink2URL: http://digikey.com/product-detail/en/EEE-1CA221XP/PCE3885TR-ND/766052; Tolerance: 20%; Voltage: 16V; Price: 0,1758; Device Package: Radial, Can - SMD; Impedance: -
C20 C21 = C1608X5R1A226M080AC: as C4 on sheet [02] ESP32-S2 Module; Value: 22uF; Part Number: C1608X5R1A226M080AC; PartId: 12987; Supplier 1: Digi-Key; Supplier Part Number 1: 445-9077-2-ND; ComponentLink1Description: Datasheet; ComponentLink1URL: https://product.tdk.com/info/en/catalog/datasheets/mlcc_commercial_general_en.pdf; ComponentLink2Description: Digi-Key Listing; ComponentLink2URL: https://www.digikey.com/product-detail/en/tdk-corporation/C1608X5R1A226M080AC/445-9077-2-ND/3661560; TemperatureCoefficient: X5R; Voltage: 10V; Price: 0,105; Device Package: 0603 (1608 Metric)
C24 = C1608X5R1A475K080AC: CAP CER 4.7UF 10V X5R 0603; Manufacturer: TDK Corporation; TemperatureRange: -55C ~ 85C; Tolerance: 10%; Value: 4.7uF; Part Number: C1608X5R1A475K080AC; PartId: 13010; Supplier 1: Digi-Key; Supplier Part Number 1: 445-5170-2-ND; ComponentLink1Description: Datasheet; ComponentLink1URL: https://product.tdk.com/info/en/catalog/datasheets/mlcc_commercial_general_en.pdf; ComponentLink2Description: Digi-Key Listing; ComponentLink2URL: https://www.digikey.com/product-detail/en/tdk-corporation/C1608X5R1A475K080AC/445-5170-2-ND/2093438; TemperatureCoefficient: X5R; Voltage: 10V; Price: 0,0333; Device Package: 0603 (1608 Metric)
C27 C28 = C0603C102K3RACTU: CAP CER 1000PF 25V X7R 0603; Manufacturer: Kemet; TemperatureRange: -55C ~ 125C; Tolerance: 10%; Value: 1000pF; Part Number: C0603C102K3RACTU; PartId: 13145; Supplier 1: Digi-Key; Supplier Part Number 1: 399-7834-2-ND; ComponentLink1Description: Datasheet; ComponentLink1URL: http://www.kemet.com/docfinder?Partnumber=C0603C102K3RACTU; ComponentLink2Description: Digi-Key Listing; ComponentLink2URL: https://www.digikey.com/product-detail/en/kemet/C0603C102K3RACTU/399-7834-2-ND/2199718; TemperatureCoefficient: X7R; Voltage: 25V; Price: 0,0041; Device Package: 0603 (1608 Metric)
C30 = C0402C101J3GACTU: CAP CER 100PF 25V NP0 0402; Manufacturer: Kemet; TemperatureRange: -55C ~ 125C; TemperatureCoefficient: C0G, NP0; Tolerance: 5%; Value: 100pF; Part Number: C0402C101J3GACTU; PartId: 12375; Supplier 1: Digi-Key; Supplier Part Number 1: 399-1022-2-ND; ComponentLink1Description: Datasheet; ComponentLink1URL: http://www.kemet.com/docfinder?Partnumber=C0402C101J3GACTU; ComponentLink2Description: Digi-Key Listing; ComponentLink2URL: https://www.digikey.com/product-detail/en/kemet/C0402C101J3GACTU/399-1022-2-ND/411024; Voltage: 25V; Price: 0,0046; Device Package: 0402 (1005 Metric)
FB2 = CIC21P101NE: as FB1 on sheet [02] ESP32-S2 Module; Part Number: CIC21P101NE; PartId: 6759; Value: 100 Ohm @ 100MHz; Supplier 1: Digi-Key; Supplier Part Number 1: 1276-6374-2-ND; ComponentLink1Description: Datasheet; ComponentLink1URL: http://www.samsungsem.com/kr/front/downloadcms.do?path=/kr/support/product-search/bead/__icsFiles/afieldfile/2014/11/13&fileName=S_CIC21J121NE.pdf; ComponentLink2Description: Digi-Key listing; ComponentLink2URL: http://digikey.com/product-detail/en/CIC21P101NE/1276-6374-2-ND/3973735; Price: 0,0163; Device Package: 0805 (2012 Metric)
FB3 = MMZ2012S181AT000: FERRITE CHIP 180 OHM 600MA 0805; Manufacturer: TDK Corporation; Type: Differential Mode - Single; DC Resistance: 150 mOhm Max; Part Number: MMZ2012S181AT000; PartId: 6805; Value: 180 Ohm @ 100MHz; Supplier 1: Digi-Key; Supplier Part Number 1: 445-2194-2-ND; ComponentLink1Description: Datasheet; ComponentLink1URL: https://product.tdk.com/info/en/catalog/datasheets/beads_commercial_signal_mmz2012_en.pdf; ComponentLink2Description: Digi-Key listing; ComponentLink2URL: http://digikey.com/product-detail/en/MMZ2012S181AT000/445-2194-2-ND/600551; Price: 0,0344; Device Package: 0805 (2012 Metric); Current Rating: 600mA
LS1 = Speaker: Loudspeaker; Published: 24-Mar-1999; LatestRevisionDate: 17-Jul-2002; LatestRevisionNote: Re-released for DXP Platform.; PackageReference: PIN2; Publisher: Altium Limited
MK1 = Mic1: Microphone; Published: 24-Mar-1999; LatestRevisionDate: 17-Jul-2002; LatestRevisionNote: Re-released for DXP Platform.; PackageReference: PIN2; Publisher: Altium Limited
R30 = CR0805-J/-000ELF: RES SMD 0.0 OHM JUMPER 1/8W 0805; Manufacturer: Bourns Inc.; TemperatureRange: -55C ~ 155C; PowerRating: 0.125W, 1/8W; Value: 0.0; Part Number: CR0805-J/-000ELF; PartId: 16155; Supplier 1: Digi-Key; Supplier Part Number 1: CR0805-J/-000ELFTR-ND; ComponentLink1Description: Datasheet; ComponentLink1URL: http://www.bourns.com/docs/Product-Datasheets/CHPREZTR.pdf; ComponentLink2Description: Digi-Key Listing; ComponentLink2URL: https://www.digikey.com/product-detail/en/bourns-inc/CR0805-J%2F-000ELF/CR0805-J%2F-000ELFTR-ND/3593157; Tolerance: Jumper; Price: 0,011; Device Package: 0805 (2012 Metric)
R31 R32 = RC0402JR-0710KL: as R21 on sheet [02] ESP32-S2 Module; Value: 10k; Part Number: RC0402JR-0710KL; PartId: 14464; Supplier 1: Digi-Key; Supplier Part Number 1: 311-10KJRTR-ND; ComponentLink1Description: Datasheet; ComponentLink1URL: http://www.yageo.com/documents/recent/PYu-RC_Group_51_RoHS_L_04.pdf; ComponentLink2Description: Digi-Key Listing; ComponentLink2URL: https://www.digikey.com/product-detail/en/yageo/RC0402JR-0710KL/311-10KJRTR-ND/726418; Tolerance: 5%; Price: 0,0017; Device Package: 0402 (1005 Metric)
R33 R34 = ERJ-2GEJ330X: as R6 on sheet [02] ESP32-S2 Module; Value: 33; Part Number: ERJ-2GEJ330X; PartId: 10984; Supplier 1: Digi-Key; Supplier Part Number 1: P33JTR-ND; ComponentLink1Description: Datasheet; ComponentLink1URL: http://industrial.panasonic.com/www-cgi/jvcr13pz.cgi?E+PZ+3+AOA0001+ERJ2GEJ330X+7+WW; ComponentLink2Description: Digi-Key Listing; ComponentLink2URL: https://www.digikey.com/product-detail/en/panasonic-electronic-components/ERJ-2GEJ330X/P33JTR-ND/146980; Tolerance: 5%; Price: 0,0019; Device Package: 0402 (1005 Metric)
R35 R36 = ERJ-3GEYJ220V: RES SMD 22 OHM 5% 1/10W 0603; Manufacturer: Panasonic Electronic Components; TemperatureRange: -55C ~ 155C; TemperatureCoefficient: 200ppm/C; PowerRating: 0.1W, 1/10W; Value: 22; Part Number: ERJ-3GEYJ220V; PartId: 11193; Supplier 1: Digi-Key; Supplier Part Number 1: P22GTR-ND; ComponentLink1Description: Datasheet; ComponentLink1URL: http://industrial.panasonic.com/www-cgi/jvcr13pz.cgi?E+PZ+3+AOA0001+ERJ3GEYJ220V+7+WW; ComponentLink2Description: Digi-Key Listing; ComponentLink2URL: https://www.digikey.com/product-detail/en/panasonic-electronic-components/ERJ-3GEYJ220V/P22GTR-ND/135600; Tolerance: 5%; Price: 0,002; Device Package: 0603 (1608 Metric)
R37 = ERJ-3GEYJ1R0V: RES SMD 1 OHM 5% 1/10W 0603; Manufacturer: Panasonic Electronic Components; TemperatureRange: -55C ~ 155C; TemperatureCoefficient: -100/ +600ppm/C; PowerRating: 0.1W, 1/10W; Value: 1; Part Number: ERJ-3GEYJ1R0V; PartId: 11204; Supplier 1: Digi-Key; Supplier Part Number 1: P1.0GTR-ND; ComponentLink1Description: Datasheet; ComponentLink1URL: http://industrial.panasonic.com/www-cgi/jvcr13pz.cgi?E+PZ+3+AOA0001+ERJ3GEYJ1R0V+7+WW; ComponentLink2Description: Digi-Key Listing; ComponentLink2URL: https://www.digikey.com/product-detail/en/panasonic-electronic-components/ERJ-3GEYJ1R0V/P1.0GTR-ND/282111; Tolerance: 5%; Price: 0,002; Device Package: 0603 (1608 Metric)
R38 = ERJ-2RKF2212X: RES SMD 22.1K OHM 1% 1/10W 0402; Manufacturer: Panasonic Electronic Components; TemperatureRange: -55C ~ 155C; TemperatureCoefficient: 100ppm/C; PowerRating: 0.1W, 1/10W; Value: 22.1k; Part Number: ERJ-2RKF2212X; PartId: 234; Supplier 1: Digi-Key; Supplier Part Number 1: P22.1KLTR-ND; ComponentLink1Description: Datasheet; ComponentLink1URL: http://industrial.panasonic.com/www-cgi/jvcr13pz.cgi?E+PZ+3+AOA0002+ERJ2RKF2212X+7+WW; ComponentLink2Description: Digikey listing; ComponentLink2URL: http://digikey.com/product-detail/en/ERJ-2RKF2212X/P22.1KLTR-ND/192228; Tolerance: 1%; Price: 0,0043; Type: Thick Film; Device Package: 0402 (1005 Metric)
R39 R40 = RC0402JR-072K2L: RES SMD 2.2K OHM 5% 1/16W 0402; Manufacturer: Yageo; TemperatureRange: -55C ~ 155C; TemperatureCoefficient: 100ppm/C; PowerRating: 0.063W, 1/16W; Value: 2.2k; Part Number: RC0402JR-072K2L; PartId: 14475; Supplier 1: Digi-Key; Supplier Part Number 1: 311-2.2KJRTR-ND; ComponentLink1Description: Datasheet; ComponentLink1URL: http://www.yageo.com/documents/recent/PYu-RC_Group_51_RoHS_L_04.pdf; ComponentLink2Description: Digi-Key Listing; ComponentLink2URL: https://www.digikey.com/product-detail/en/yageo/RC0402JR-072K2L/311-2.2KJRTR-ND/726436; Tolerance: 5%; Price: 0,0017; Device Package: 0402 (1005 Metric)
U1 = ES8374: IC AMP AUDIO CODEC  1.8W QFN28; Manufacturer: Evereset Semi; Output Type: 1-Channel (Mono); Max Output Power x Channels @ Load: 1.8W x1 @ 4Ω 4.2V; Voltage Supply: 3.3 V ~ 5 V; Part Number: ES8374; PartId: 9316; Supplier 1: LCSC; Supplier Part Number 1: ES8374; ComponentLink1Description: Datasheet; ComponentLink1URL: https://datasheet.lcsc.com/szlcsc/1912111437_Everest-semi-Everest-Semiconductor-ES8374_C365738.pdf; ComponentLink2Description: LCSC Listing; ComponentLink2URL: https://lcsc.com/product-detail/Codec-ICs_Everest-Semiconductor-ES8374_C365738.html; Type: Class D; Device Package: 28-QFN; Operating Temperature: -40C ~ 85C (TA)